# Altium schematic sheet nufsr-power.schdoc: NUSense
size A4; Organization: Elby Designs; Address1: 9 Follan Close; Address2: Kariong; Address3: NSW 2250; Address4: Australia; Revision: 1; SheetNumber: 14; SheetTotal: 15; DrawnBy: Power Supply; Engineer: Laurie Biddulph; PageSetup: Record=PageOptions|CenterHorizontal=True|CenterVertical=True|PrintScale=1.38|XCorrection=1.00|YCorrection=1.00|PrintKind=1|BorderSize=5000000|LeftOffset=0|BottomOffset=0|Orientation=2|PaperLength=1000|PaperWidth=1000|Scale=100|PaperSource=7|PrintQuality=-4|MediaType=1|DitherType=10|PaperKind=A3|PrintScaleMode=1
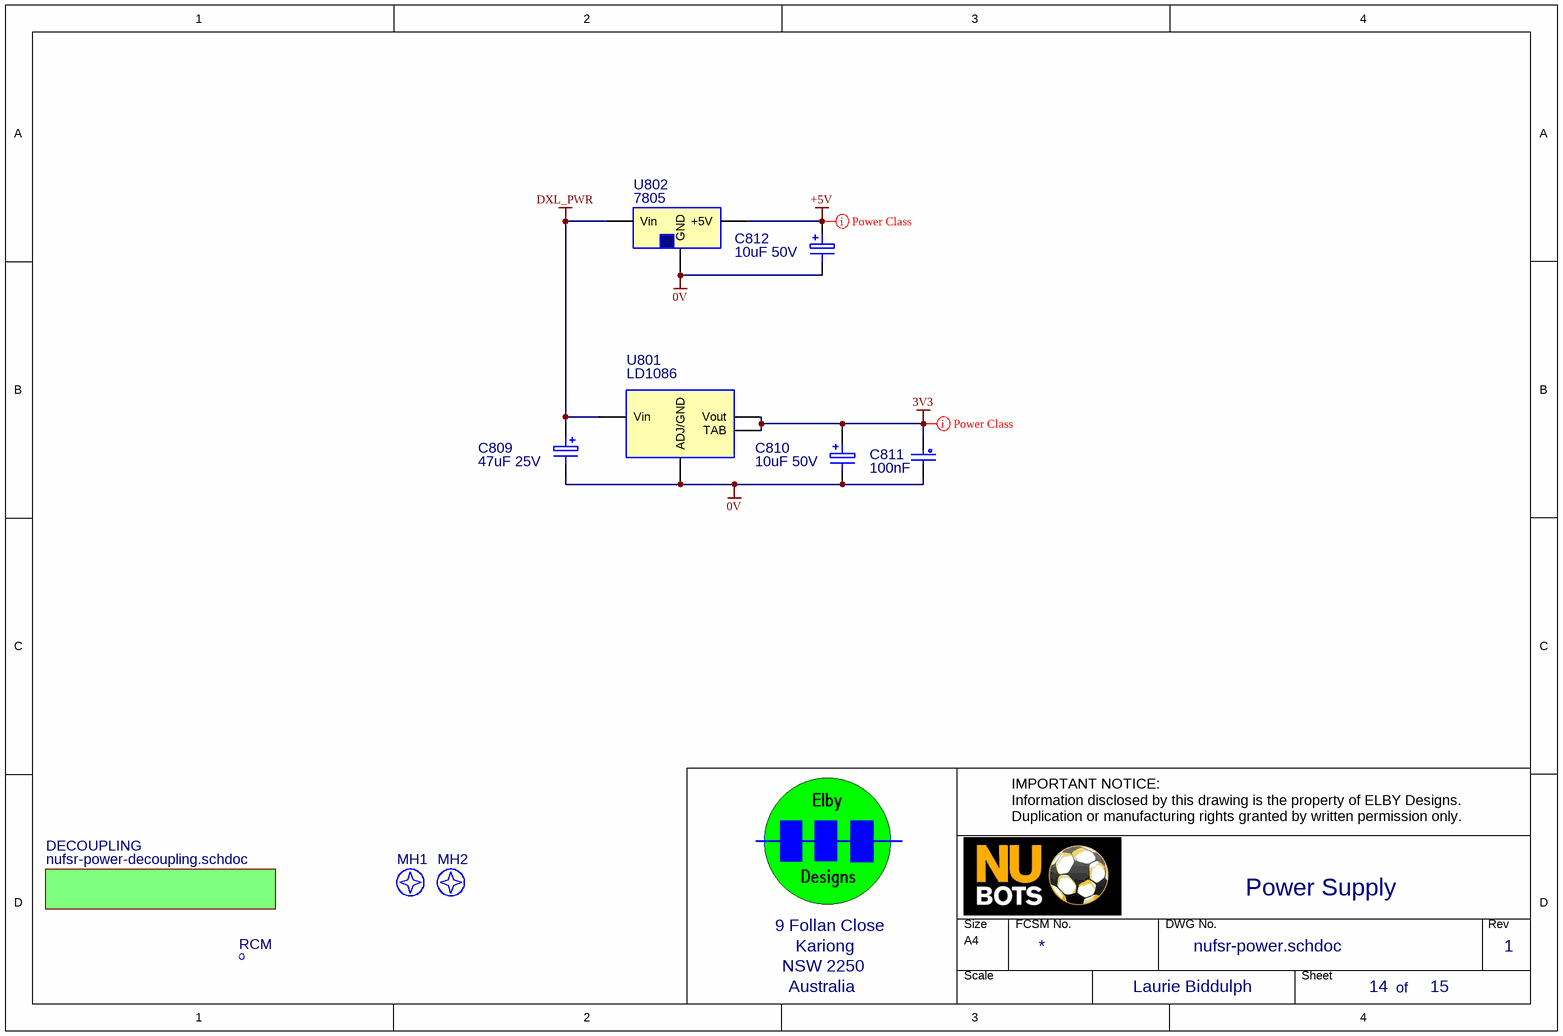
[diagram p0: nufsr-power.schdoc]

## Parts
C809  47uF 25V  [CASE-D(LB)]
C810  10uF 50V  [RB-D6.3-P2.5]
C811  100nF  [0603(LB)]
C812  10uF 50V  [RB-D6.3-P2.5]
MH1  Fixing  [HW-FIXING-3MM-PLASTIC]  (value not drawn)
MH2  Fixing  [HW-FIXING-3MM-PLASTIC]  (value not drawn)
RCM  HW-RCM(LB)  [HW-RCM]  (value not drawn)
U801  LD1086  [DPAK(LB)]
U802  7805  [DPAK(LB)]

## Sub-sheets
DECOUPLING = nufsr-power-decoupling.schdoc: no entries

## Nets
0V: C809.2 C810.2 C811.2 C812.2 U801.1(ADJ/GND) U802.2(GND)
3V3: C810.1 C811.1 U801.2(Vout) U801.TAB
+5V: C812.1 U802.3(+5V)
DXL_PWR: C809.1 U801.3(Vin) U802.1(Vin)

Not connected (* = marked no-connect by the designer): U802 TAB

## Layout directives
net class PowerClass: 3V3, +5V

## Notes on the sheet
- IMPORTANT NOTICE:
  Information disclosed by this drawing is the property of ELBY Designs.
  Duplication or manufacturing rights granted by written permission only.
- of

## Library data of the parts
C809 = CT-47UF35V(LB): 20% 35V Resin-dipped Tantalum; EMRP: CT-47UF
C810 C812 = CE-10UF50V(LB): 20% 50V Aluminium Electrolytic; EMRP: CE-10UF
C811 = CC-100NF(LB): Monolithic Ceramic; EMRP: CC-100NF
MH1 MH2 = HW-FIXING-ISOLATED(LB): M3/M4 Fixing Hole; EMRP: NA
RCM = HW-RCM(LB): N-Tick; EMRP: NA
U801 = LD1086(LB): 3-terminal Positive Voltage Regulator; Text Field1: 347-6870; Text Field2: ZV-1615; Text Field3: 512-KA317
U802 = 7805(LB): 3-terminal 1Amp Fixed Voltage Regulator; EMRP: SI-4-7805